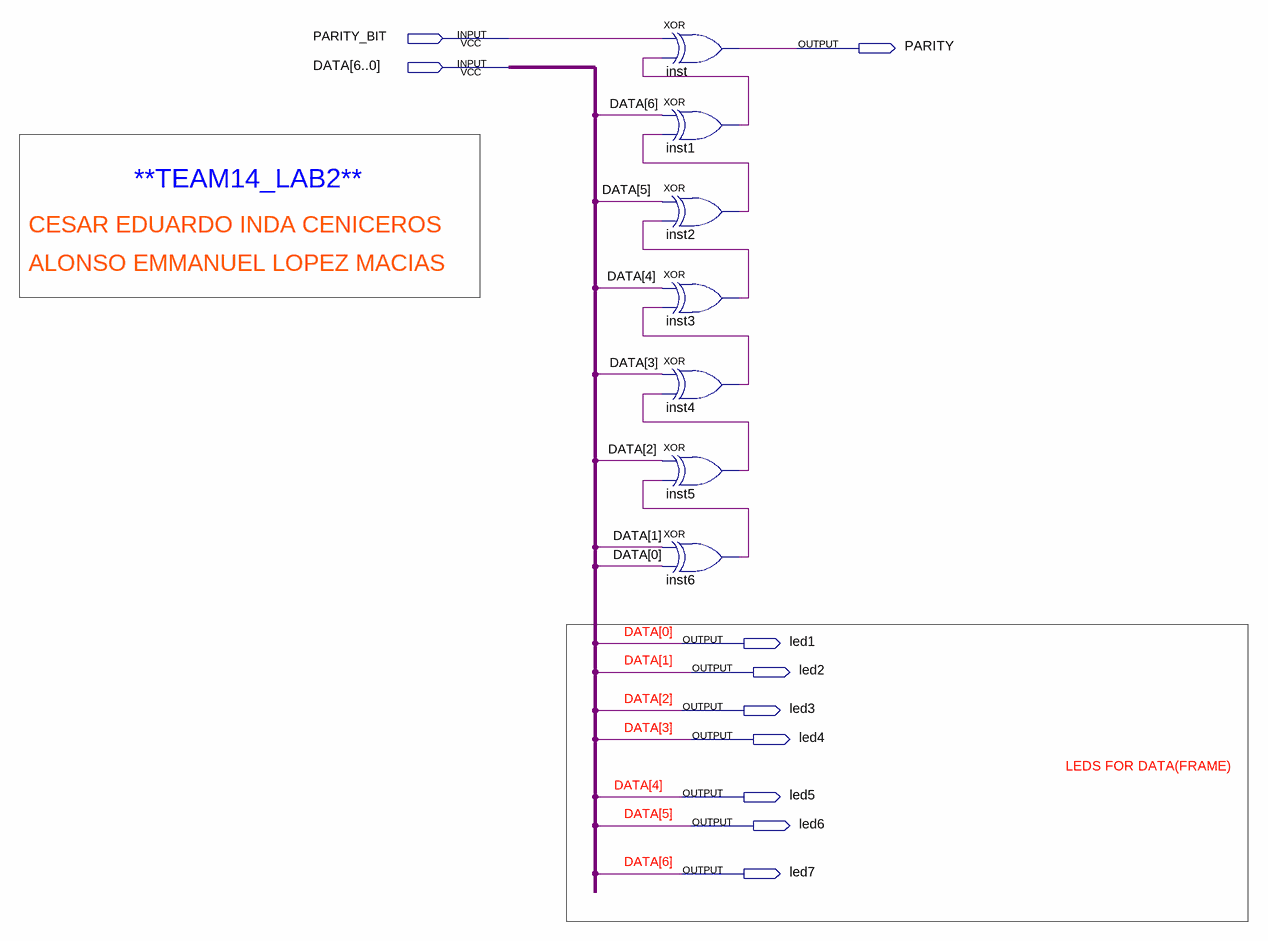
[diagram p0: schematic sheet]
// Quartus schematic ParityBit.bdf as structural Verilog: 7 symbols, 10 pins
module ParityBit (
  input  PARITY_BIT,
  input  [6:0] DATA,
  output PARITY,
  output led1,
  output led2,
  output led3,
  output led4,
  output led5,
  output led6,
  output led7
);

  wire inst1_out, inst2_out, inst3_out, inst4_out, inst5_out, inst6_out;

  xor inst (PARITY, PARITY_BIT, inst1_out);
  xor inst1 (inst1_out, DATA[6], inst2_out);
  xor inst2 (inst2_out, DATA[5], inst3_out);
  xor inst3 (inst3_out, DATA[4], inst4_out);
  xor inst4 (inst4_out, DATA[3], inst5_out);
  xor inst5 (inst5_out, DATA[2], inst6_out);
  xor inst6 (inst6_out, DATA[1], DATA[0]);

  assign led1 = DATA[0];
  assign led2 = DATA[1];
  assign led3 = DATA[2];
  assign led4 = DATA[3];
  assign led5 = DATA[4];
  assign led6 = DATA[5];
  assign led7 = DATA[6];

  // Notes on the sheet:
  //   **TEAM14_LAB2**
  //   CESAR EDUARDO INDA CENICEROS
  //   ALONSO EMMANUEL LOPEZ MACIAS
  //   LEDS FOR DATA(FRAME)
endmodule
